# Altium schematic sheet SwitchConnectors.SchDoc
size A
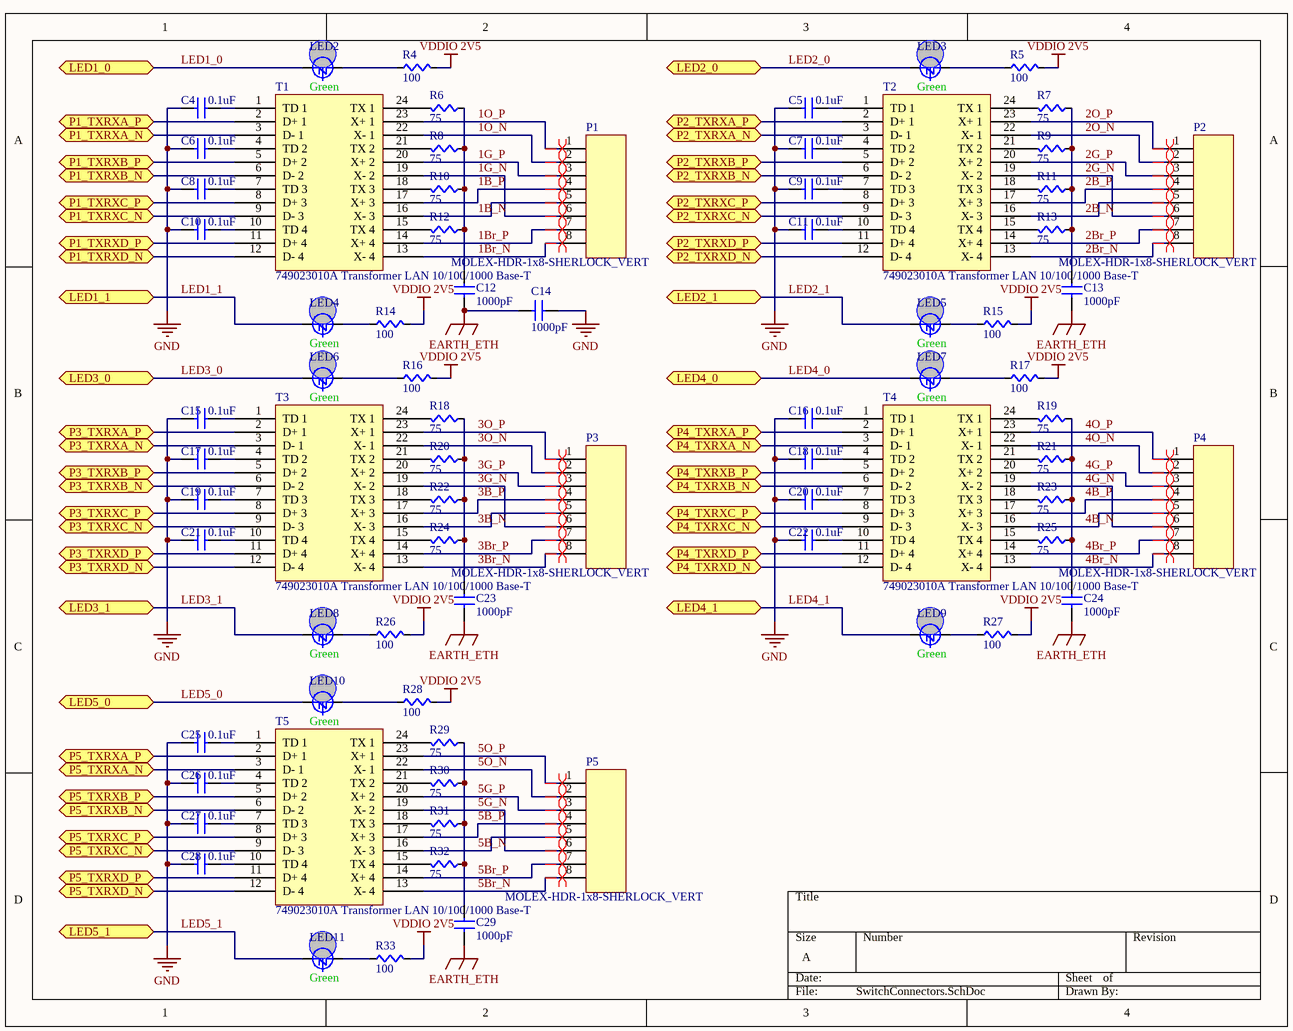
[diagram p0: SwitchConnectors.SchDoc]

## Parts
C4  value 0.1uF  [CAPC0603]  (hidden comment: Cap)
C5  value 0.1uF  [CAPC0603]  (hidden comment: Cap)
C6  value 0.1uF  [CAPC0603]  (hidden comment: Cap)
C7  value 0.1uF  [CAPC0603]  (hidden comment: Cap)
C8  value 0.1uF  [CAPC0603]  (hidden comment: Cap)
C9  value 0.1uF  [CAPC0603]  (hidden comment: Cap)
C10  value 0.1uF  [CAPC0603]  (hidden comment: Cap)
C11  value 0.1uF  [CAPC0603]  (hidden comment: Cap)
C12  value 1000pF  [CAPC0603]  (hidden comment: Cap)
C13  value 1000pF  [CAPC0603]  (hidden comment: Cap)
C14  value 1000pF  [CAPC0603]  (hidden comment: Cap)
C15  value 0.1uF  [CAPC0603]  (hidden comment: Cap)
C16  value 0.1uF  [CAPC0603]  (hidden comment: Cap)
C17  value 0.1uF  [CAPC0603]  (hidden comment: Cap)
C18  value 0.1uF  [CAPC0603]  (hidden comment: Cap)
C19  value 0.1uF  [CAPC0603]  (hidden comment: Cap)
C20  value 0.1uF  [CAPC0603]  (hidden comment: Cap)
C21  value 0.1uF  [CAPC0603]  (hidden comment: Cap)
C22  value 0.1uF  [CAPC0603]  (hidden comment: Cap)
C23  value 1000pF  [CAPC0603]  (hidden comment: Cap)
C24  value 1000pF  [CAPC0603]  (hidden comment: Cap)
C25  value 0.1uF  [CAPC0603]  (hidden comment: Cap)
C26  value 0.1uF  [CAPC0603]  (hidden comment: Cap)
C27  value 0.1uF  [CAPC0603]  (hidden comment: Cap)
C28  value 0.1uF  [CAPC0603]  (hidden comment: Cap)
C29  value 1000pF  [CAPC0603]  (hidden comment: Cap)
LED2  Color: Green  [LED0603]  (hidden comment: LED)
LED3  Color: Green  [LED0603]  (hidden comment: LED)
LED4  Color: Green  [LED0603]  (hidden comment: LED)
LED5  Color: Green  [LED0603]  (hidden comment: LED)
LED6  Color: Green  [LED0603]  (hidden comment: LED)
LED7  Color: Green  [LED0603]  (hidden comment: LED)
LED8  Color: Green  [LED0603]  (hidden comment: LED)
LED9  Color: Green  [LED0603]  (hidden comment: LED)
LED10  Color: Green  [LED0603]  (hidden comment: LED)
LED11  Color: Green  [LED0603]  (hidden comment: LED)
P1  MOLEX-HDR-1x8-SHERLOCK_VERT  [MOLEX-HDR-1X8-SHERLOCK-VERT]
P2  MOLEX-HDR-1x8-SHERLOCK_VERT  [MOLEX-HDR-1X8-SHERLOCK-VERT]
P3  MOLEX-HDR-1x8-SHERLOCK_VERT  [MOLEX-HDR-1X8-SHERLOCK-VERT]
P4  MOLEX-HDR-1x8-SHERLOCK_VERT  [MOLEX-HDR-1X8-SHERLOCK-VERT]
P5  MOLEX-HDR-1x8-SHERLOCK_VERT  [MOLEX-HDR-1X8-SHERLOCK-VERT]
R4  value 100  [RES0603]  (hidden comment: Res)
R5  value 100  [RES0603]  (hidden comment: Res)
R6  value 75  [RES0603]  (hidden comment: Res)
R7  value 75  [RES0603]  (hidden comment: Res)
R8  value 75  [RES0603]  (hidden comment: Res)
R9  value 75  [RES0603]  (hidden comment: Res)
R10  value 75  [RES0603]  (hidden comment: Res)
R11  value 75  [RES0603]  (hidden comment: Res)
R12  value 75  [RES0603]  (hidden comment: Res)
R13  value 75  [RES0603]  (hidden comment: Res)
R14  value 100  [RES0603]  (hidden comment: Res)
R15  value 100  [RES0603]  (hidden comment: Res)
R16  value 100  [RES0603]  (hidden comment: Res)
R17  value 100  [RES0603]  (hidden comment: Res)
R18  value 75  [RES0603]  (hidden comment: Res)
R19  value 75  [RES0603]  (hidden comment: Res)
R20  value 75  [RES0603]  (hidden comment: Res)
R21  value 75  [RES0603]  (hidden comment: Res)
R22  value 75  [RES0603]  (hidden comment: Res)
R23  value 75  [RES0603]  (hidden comment: Res)
R24  value 75  [RES0603]  (hidden comment: Res)
R25  value 75  [RES0603]  (hidden comment: Res)
R26  value 100  [RES0603]  (hidden comment: Res)
R27  value 100  [RES0603]  (hidden comment: Res)
R28  value 100  [RES0603]  (hidden comment: Res)
R29  value 75  [RES0603]  (hidden comment: Res)
R30  value 75  [RES0603]  (hidden comment: Res)
R31  value 75  [RES0603]  (hidden comment: Res)
R32  value 75  [RES0603]  (hidden comment: Res)
R33  value 100  [RES0603]  (hidden comment: Res)
T1  749023010A Transformer LAN 10/100/1000 Base-T  [749023010A]
T2  749023010A Transformer LAN 10/100/1000 Base-T  [749023010A]
T3  749023010A Transformer LAN 10/100/1000 Base-T  [749023010A]
T4  749023010A Transformer LAN 10/100/1000 Base-T  [749023010A]
T5  749023010A Transformer LAN 10/100/1000 Base-T  [749023010A]

## Ports
LED1_0 (bidir), LED1_1 (bidir), LED2_0 (bidir), LED2_1 (bidir), LED3_0 (bidir), LED3_1 (bidir), LED4_0 (bidir), LED4_1 (bidir), LED5_0 (bidir), LED5_1 (bidir), P1_TXRXA_N (bidir), P1_TXRXA_P (bidir), P1_TXRXB_N (bidir), P1_TXRXB_P (bidir), P1_TXRXC_N (bidir), P1_TXRXC_P (bidir), P1_TXRXD_N (bidir), P1_TXRXD_P (bidir), P2_TXRXA_N (bidir), P2_TXRXA_P (bidir), P2_TXRXB_N (bidir), P2_TXRXB_P (bidir), P2_TXRXC_N (bidir), P2_TXRXC_P (bidir), P2_TXRXD_N (bidir), P2_TXRXD_P (bidir), P3_TXRXA_N (bidir), P3_TXRXA_P (bidir), P3_TXRXB_N (bidir), P3_TXRXB_P (bidir), P3_TXRXC_N (bidir), P3_TXRXC_P (bidir), P3_TXRXD_N (bidir), P3_TXRXD_P (bidir), P4_TXRXA_N (bidir), P4_TXRXA_P (bidir), P4_TXRXB_N (bidir), P4_TXRXB_P (bidir), P4_TXRXC_N (bidir), P4_TXRXC_P (bidir), P4_TXRXD_N (bidir), P4_TXRXD_P (bidir), P5_TXRXA_N (bidir), P5_TXRXA_P (bidir), P5_TXRXB_N (bidir), P5_TXRXB_P (bidir), P5_TXRXC_N (bidir), P5_TXRXC_P (bidir), P5_TXRXD_N (bidir), P5_TXRXD_P (bidir)

## Nets
EARTH_ETH: C12.1(A) C13.1(A) C14.2(B) C23.1(A) C24.1(A) C29.1(A)
GND: C4.1(A) C5.1(A) C6.1(A) C7.1(A) C8.1(A) C9.1(A) C10.1(A) C11.1(A) C14.1(A) C15.1(A) C16.1(A) C17.1(A) C18.1(A) C19.1(A) C20.1(A) C21.1(A) C22.1(A) C25.1(A) C26.1(A) C27.1(A) C28.1(A)
VDDIO 2V5: R4.1(A) R5.1(A) R14.1(A) R15.1(A) R16.1(A) R17.1(A) R26.1(A) R27.1(A) R28.1(A) R33.1(A)
1B_N: P1.5 T1.16(X-_3)
1B_P: P1.4 T1.17(X+_3)
1Br_N: P1.8 T1.13(X-_4)
1Br_P: P1.7 T1.14(X+_4)
1G_N: P1.6 T1.19(X-_2)
1G_P: P1.3 T1.20(X+_2)
1O_N: P1.2 T1.22(X-_1)
1O_P: P1.1 T1.23(X+_1)
2B_N: P2.5 T2.16(X-_3)
2B_P: P2.4 T2.17(X+_3)
2Br_N: P2.8 T2.13(X-_4)
2Br_P: P2.7 T2.14(X+_4)
2G_N: P2.6 T2.19(X-_2)
2G_P: P2.3 T2.20(X+_2)
2O_N: P2.2 T2.22(X-_1)
2O_P: P2.1 T2.23(X+_1)
3B_N: P3.5 T3.16(X-_3)
3B_P: P3.4 T3.17(X+_3)
3Br_N: P3.8 T3.13(X-_4)
3Br_P: P3.7 T3.14(X+_4)
3G_N: P3.6 T3.19(X-_2)
3G_P: P3.3 T3.20(X+_2)
3O_N: P3.2 T3.22(X-_1)
3O_P: P3.1 T3.23(X+_1)
4B_N: P4.5 T4.16(X-_3)
4B_P: P4.4 T4.17(X+_3)
4Br_N: P4.8 T4.13(X-_4)
4Br_P: P4.7 T4.14(X+_4)
4G_N: P4.6 T4.19(X-_2)
4G_P: P4.3 T4.20(X+_2)
4O_N: P4.2 T4.22(X-_1)
4O_P: P4.1 T4.23(X+_1)
5B_N: P5.5 T5.16(X-_3)
5B_P: P5.4 T5.17(X+_3)
5Br_N: P5.8 T5.13(X-_4)
5Br_P: P5.7 T5.14(X+_4)
5G_N: P5.6 T5.19(X-_2)
5G_P: P5.3 T5.20(X+_2)
5O_N: P5.2 T5.22(X-_1)
5O_P: P5.1 T5.23(X+_1)
LED1_0: LED2.C ; port LED1_0
LED1_1: LED4.C ; port LED1_1
LED2_0: LED3.C ; port LED2_0
LED2_1: LED5.C ; port LED2_1
LED3_0: LED6.C ; port LED3_0
LED3_1: LED8.C ; port LED3_1
LED4_0: LED7.C ; port LED4_0
LED4_1: LED9.C ; port LED4_1
LED5_0: LED10.C ; port LED5_0
LED5_1: LED11.C ; port LED5_1
P1_TXRXA_N: T1.3(D-_1) ; port P1_TXRXA_N
P1_TXRXA_P: T1.2(D+_1) ; port P1_TXRXA_P
P1_TXRXB_N: T1.6(D-_2) ; port P1_TXRXB_N
P1_TXRXB_P: T1.5(D+_2) ; port P1_TXRXB_P
P1_TXRXC_N: T1.9(D-_3) ; port P1_TXRXC_N
P1_TXRXC_P: T1.8(D+_3) ; port P1_TXRXC_P
P1_TXRXD_N: T1.12(D-_4) ; port P1_TXRXD_N
P1_TXRXD_P: T1.11(D+_4) ; port P1_TXRXD_P
P2_TXRXA_N: T2.3(D-_1) ; port P2_TXRXA_N
P2_TXRXA_P: T2.2(D+_1) ; port P2_TXRXA_P
P2_TXRXB_N: T2.6(D-_2) ; port P2_TXRXB_N
P2_TXRXB_P: T2.5(D+_2) ; port P2_TXRXB_P
P2_TXRXC_N: T2.9(D-_3) ; port P2_TXRXC_N
P2_TXRXC_P: T2.8(D+_3) ; port P2_TXRXC_P
P2_TXRXD_N: T2.12(D-_4) ; port P2_TXRXD_N
P2_TXRXD_P: T2.11(D+_4) ; port P2_TXRXD_P
P3_TXRXA_N: T3.3(D-_1) ; port P3_TXRXA_N
P3_TXRXA_P: T3.2(D+_1) ; port P3_TXRXA_P
P3_TXRXB_N: T3.6(D-_2) ; port P3_TXRXB_N
P3_TXRXB_P: T3.5(D+_2) ; port P3_TXRXB_P
P3_TXRXC_N: T3.9(D-_3) ; port P3_TXRXC_N
P3_TXRXC_P: T3.8(D+_3) ; port P3_TXRXC_P
P3_TXRXD_N: T3.12(D-_4) ; port P3_TXRXD_N
P3_TXRXD_P: T3.11(D+_4) ; port P3_TXRXD_P
P4_TXRXA_N: T4.3(D-_1) ; port P4_TXRXA_N
P4_TXRXA_P: T4.2(D+_1) ; port P4_TXRXA_P
P4_TXRXB_N: T4.6(D-_2) ; port P4_TXRXB_N
P4_TXRXB_P: T4.5(D+_2) ; port P4_TXRXB_P
P4_TXRXC_N: T4.9(D-_3) ; port P4_TXRXC_N
P4_TXRXC_P: T4.8(D+_3) ; port P4_TXRXC_P
P4_TXRXD_N: T4.12(D-_4) ; port P4_TXRXD_N
P4_TXRXD_P: T4.11(D+_4) ; port P4_TXRXD_P
P5_TXRXA_N: T5.3(D-_1) ; port P5_TXRXA_N
P5_TXRXA_P: T5.2(D+_1) ; port P5_TXRXA_P
P5_TXRXB_N: T5.6(D-_2) ; port P5_TXRXB_N
P5_TXRXB_P: T5.5(D+_2) ; port P5_TXRXB_P
P5_TXRXC_N: T5.9(D-_3) ; port P5_TXRXC_N
P5_TXRXC_P: T5.8(D+_3) ; port P5_TXRXC_P
P5_TXRXD_N: T5.12(D-_4) ; port P5_TXRXD_N
P5_TXRXD_P: T5.11(D+_4) ; port P5_TXRXD_P
NetC4_2: C4.2(B) T1.1(TD_1)
NetC5_2: C5.2(B) T2.1(TD_1)
NetC6_2: C6.2(B) T1.4(TD_2)
NetC7_2: C7.2(B) T2.4(TD_2)
NetC8_2: C8.2(B) T1.7(TD_3)
NetC9_2: C9.2(B) T2.7(TD_3)
NetC10_2: C10.2(B) T1.10(TD_4)
NetC11_2: C11.2(B) T2.10(TD_4)
NetC12_2: C12.2(B) R6.2(B) R8.2(B) R10.2(B) R12.2(B)
NetC13_2: C13.2(B) R7.2(B) R9.2(B) R11.2(B) R13.2(B)
NetC15_2: C15.2(B) T3.1(TD_1)
NetC16_2: C16.2(B) T4.1(TD_1)
NetC17_2: C17.2(B) T3.4(TD_2)
NetC18_2: C18.2(B) T4.4(TD_2)
NetC19_2: C19.2(B) T3.7(TD_3)
NetC20_2: C20.2(B) T4.7(TD_3)
NetC21_2: C21.2(B) T3.10(TD_4)
NetC22_2: C22.2(B) T4.10(TD_4)
NetC23_2: C23.2(B) R18.2(B) R20.2(B) R22.2(B) R24.2(B)
NetC24_2: C24.2(B) R19.2(B) R21.2(B) R23.2(B) R25.2(B)
NetC25_2: C25.2(B) T5.1(TD_1)
NetC26_2: C26.2(B) T5.4(TD_2)
NetC27_2: C27.2(B) T5.7(TD_3)
NetC28_2: C28.2(B) T5.10(TD_4)
NetC29_2: C29.2(B) R29.2(B) R30.2(B) R31.2(B) R32.2(B)
NetLED2_A: LED2.A R4.2(B)
NetLED3_A: LED3.A R5.2(B)
NetLED4_A: LED4.A R14.2(B)
NetLED5_A: LED5.A R15.2(B)
NetLED6_A: LED6.A R16.2(B)
NetLED7_A: LED7.A R17.2(B)
NetLED8_A: LED8.A R26.2(B)
NetLED9_A: LED9.A R27.2(B)
NetLED10_A: LED10.A R28.2(B)
NetLED11_A: LED11.A R33.2(B)
NetR6_1: R6.1(A) T1.24(TX_1)
NetR7_1: R7.1(A) T2.24(TX_1)
NetR8_1: R8.1(A) T1.21(TX_2)
NetR9_1: R9.1(A) T2.21(TX_2)
NetR10_1: R10.1(A) T1.18(TX_3)
NetR11_1: R11.1(A) T2.18(TX_3)
NetR12_1: R12.1(A) T1.15(TX_4)
NetR13_1: R13.1(A) T2.15(TX_4)
NetR18_1: R18.1(A) T3.24(TX_1)
NetR19_1: R19.1(A) T4.24(TX_1)
NetR20_1: R20.1(A) T3.21(TX_2)
NetR21_1: R21.1(A) T4.21(TX_2)
NetR22_1: R22.1(A) T3.18(TX_3)
NetR23_1: R23.1(A) T4.18(TX_3)
NetR24_1: R24.1(A) T3.15(TX_4)
NetR25_1: R25.1(A) T4.15(TX_4)
NetR29_1: R29.1(A) T5.24(TX_1)
NetR30_1: R30.1(A) T5.21(TX_2)
NetR31_1: R31.1(A) T5.18(TX_3)
NetR32_1: R32.1(A) T5.15(TX_4)

## Layout directives
differential pair: 1B_N, 1B_P, 1Br_N, 1Br_P, 1G_N, 1G_P, 1O_N, 1O_P, 2B_N, 2B_P, 2Br_N, 2Br_P, 2G_N, 2G_P, 2O_N, 2O_P, 3B_N, 3B_P, 3Br_N, 3Br_P, 3G_N, 3G_P, 3O_N, 3O_P, 4B_N, 4B_P, 4Br_N, 4Br_P, 4G_N, 4G_P, 4O_N, 4O_P, 5B_N, 5B_P, 5Br_N, 5Br_P, 5G_N, 5G_P, 5O_N, 5O_P

## Library data of the parts
P1-P5 = MOLEX-HDR-1x8-SHERLOCK_VERT: CONN HEADER 8POS 2MM VERT TIN; Supplier 1: Digi-Key; Supplier Part Number 1: WM18926-ND
T1-T5 = 749023010A Transformer LAN 10/100/1000 Base-T: TRANSFORMER LAN 10/100/1000 SMD; Supplier 1: Digi-Key; Supplier Part Number 1: 732-5714-1-ND
C4-C29 = Cap: Supplier 1: Digi-Key
  C4-C11 C15-C22 C25-C28: Supplier Part Number 1: 1276-1000-1-ND
  C12-C14 C23 C24 C29: Supplier Part Number 1: 1276-1018-1-ND
LED2-LED11 = LED: Supplier 1: Digi-Key; Supplier Part Number 1: 754-1121-1-ND
R4-R33 = Res: Supplier 1: Digi-Key
  R4 R5 R14-R17 R26-R28 R33: Supplier Part Number 1: RMCF0603JT100RCT-ND
  R6-R13 R18-R25 R29-R32: Supplier Part Number 1: RMCF0603FT75R0CT-ND